# EAGLE design RescueLS (EAGLE 9.6.0)

## Sheet 1 of 2
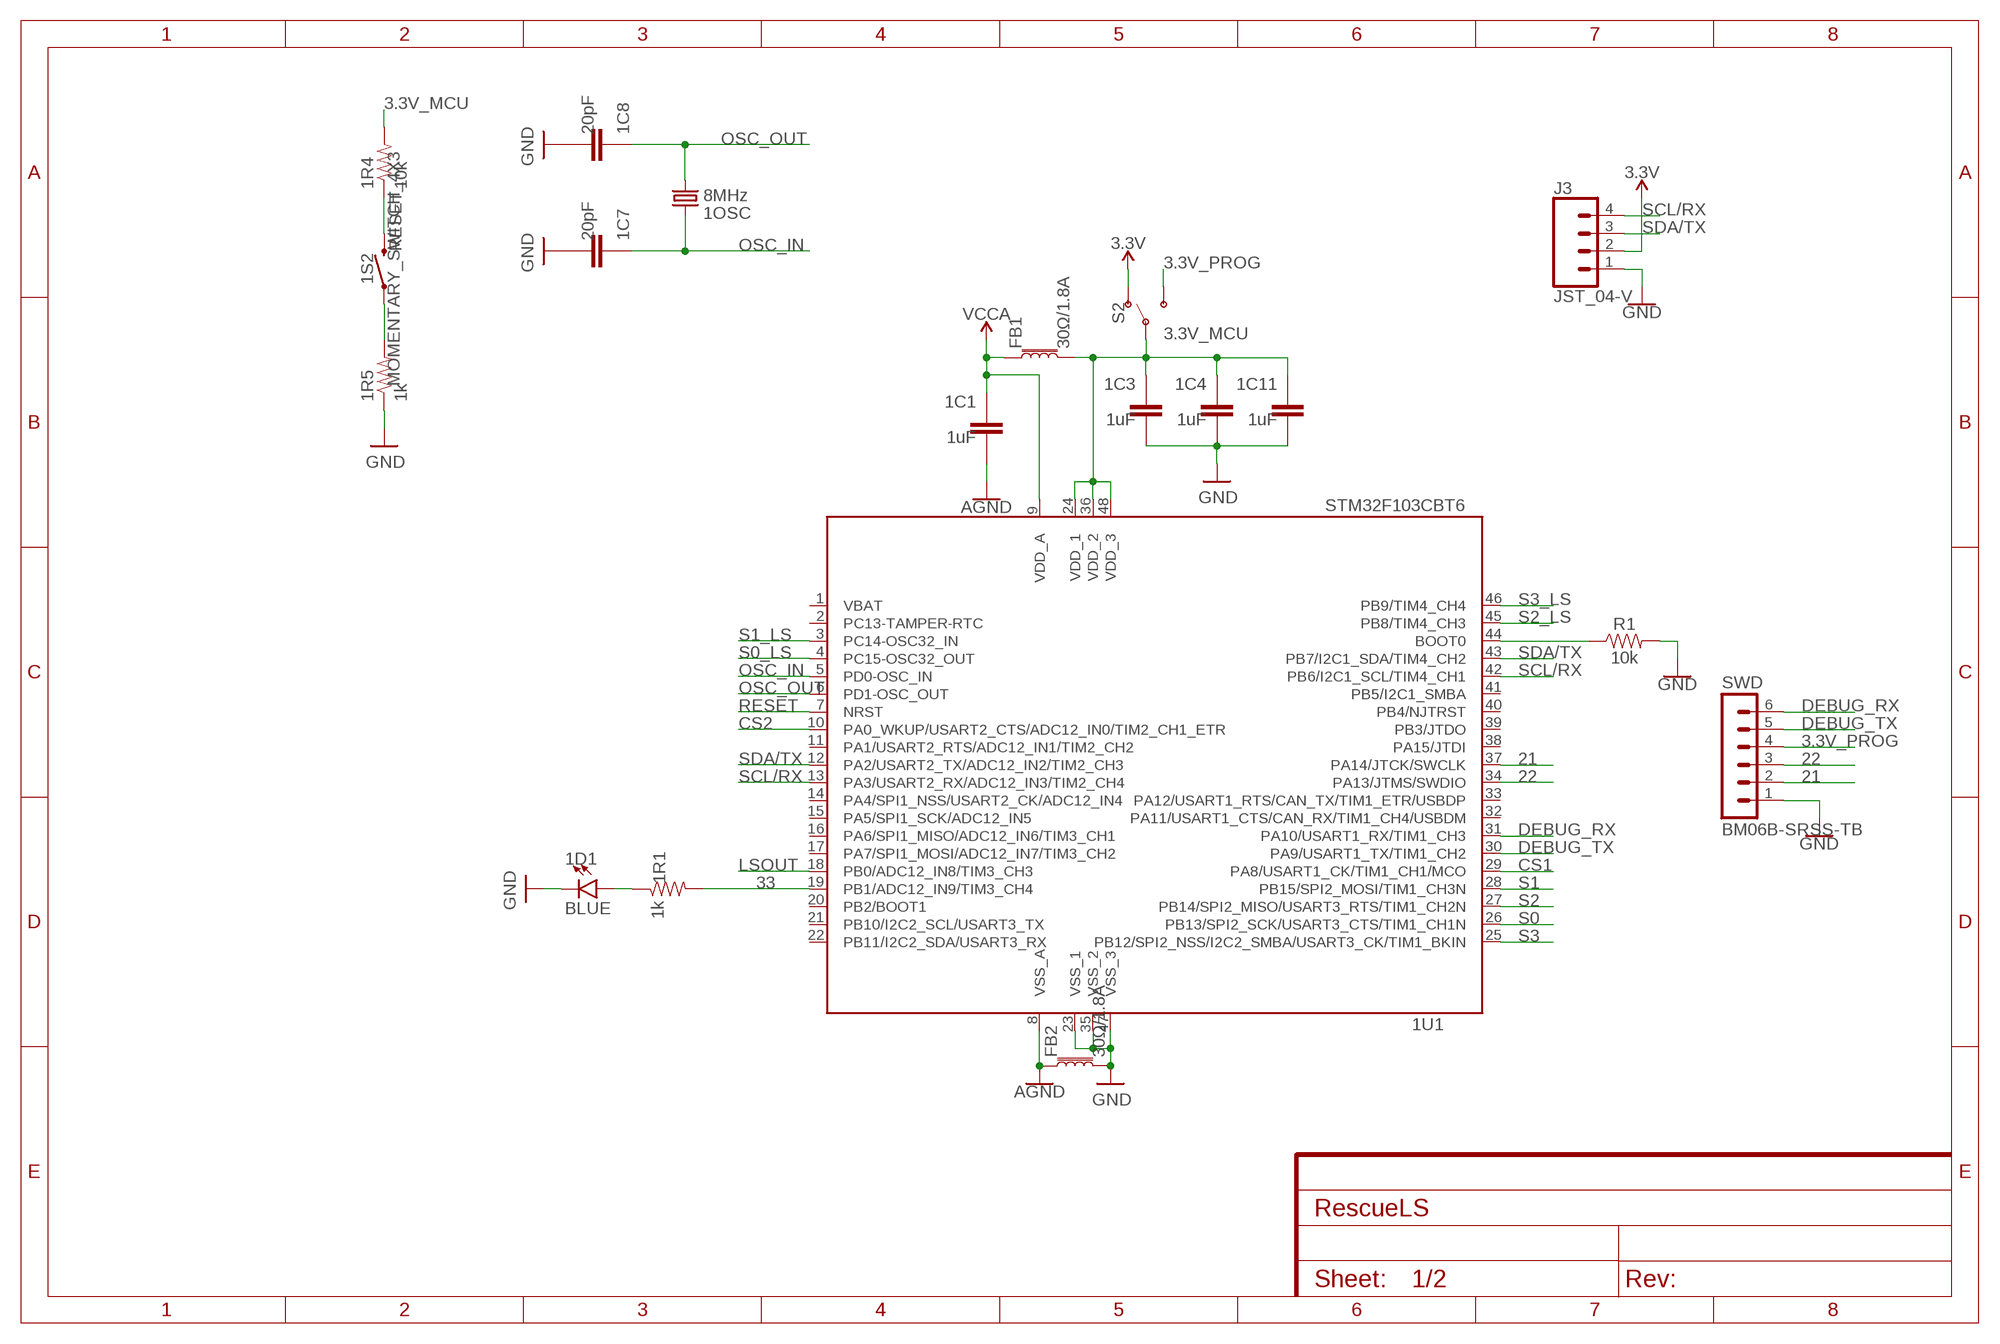
[diagram p0: schematic, sheet 1]

### Parts
1C1  1uF  CAPACITOR0603  [C0603]
1C3  1uF  CAPACITOR0603  [C0603]
1C4  1uF  CAPACITOR0603  [C0603]
1C7  20pF  CAPACITOR0603  [C0603]
1C8  20pF  CAPACITOR0603  [C0603]
1C11  1uF  CAPACITOR0603  [C0603]
1D1  BLUE  LED-BLUE0603  [LED-0603]
1OSC  8MHz  CRYSTALSMD-5X3.2-2PAD  [CRYSTAL-SMD-5X3.2-2PAD]
1R1  1k  RESISTOR0603  [R0603]
1R4  10k  RESISTOR0603  [R0603]
1R5  1k  RESISTOR0603  [R0603]
1S2  MOMENTARY_SWITCH_4X3  [MOMENTARY_SWITCH_4X3]
1U1  STM32F103CBT6  [LQFP48]
FB1  30Ω/1.8A  FERRITE_BEAD-0603  [0603]
FB2  30Ω/1.8A  FERRITE_BEAD-0603  [0603]
J3  JST_04-V  [JST_04-V]
R1  10k  RESISTOR0603  [R0603]
S2  SWITCH-SPDT-PTH-11.6X4.0MM-LOCK  [SWITCH_SPDT_PTH_11.6X4.0MM_LOCK]
SWD  BM06B-SRSS-TB  [BM06B-SRSS-TB]

### Nets
3.3V: J3.2 S2.1(O) ; also sheet 2
3.3V_MCU: 1C3.1 1C4.1 1C11.1 1R4.2 1U1.24(VDD_1) 1U1.36(VDD_2) 1U1.48(VDD_3) FB1.2 S2.2(P) ; also sheet 2
3.3V_PROG: S2.3(S) SWD.4
21: 1U1.37(PA14/JTCK/SWCLK) SWD.2
22: 1U1.34(PA13/JTMS/SWDIO) SWD.3
33: 1R1.2 1U1.19(PB1/ADC12_IN9/TIM3_CH4)
AGND: 1C1.2 1U1.8(VSS_A) FB2.1 ; also sheet 2
CS1: 1U1.29(PA8/USART1_CK/TIM1_CH1/MCO) ; also sheet 2
CS2: 1U1.10(PA0_WKUP/USART2_CTS/ADC12_IN0/TIM2_CH1_ETR) ; also sheet 2
DEBUG_RX: 1U1.31(PA10/USART1_RX/TIM1_CH3) SWD.6
DEBUG_TX: 1U1.30(PA9/USART1_TX/TIM1_CH2) SWD.5
GND: 1C3.2 1C4.2 1C7.2 1C8.2 1C11.2 1D1.C 1R5.1 1U1.23(VSS_1) 1U1.35(VSS_2) 1U1.47(VSS_3) FB2.2 J3.1 R1.2 SWD.1 ; also sheet 2
LSOUT: 1U1.18(PB0/ADC12_IN8/TIM3_CH3) ; also sheet 2
N$2: 1D1.A 1R1.1
N$4: 1R5.2 1S2.P$1
N$23: 1U1.44(BOOT0) R1.1
OSC_IN: 1C7.1 1OSC.P$2 1U1.5(PD0-OSC_IN)
OSC_OUT: 1C8.1 1OSC.P$1 1U1.6(PD1-OSC_OUT)
RESET: 1R4.1 1S2.P$2 1U1.7(NRST)
S0: 1U1.26(PB13/SPI2_SCK/USART3_CTS/TIM1_CH1N) ; also sheet 2
S0_LS: 1U1.4(PC15-OSC32_OUT) ; also sheet 2
S1: 1U1.28(PB15/SPI2_MOSI/TIM1_CH3N) ; also sheet 2
S1_LS: 1U1.3(PC14-OSC32_IN) ; also sheet 2
S2: 1U1.27(PB14/SPI2_MISO/USART3_RTS/TIM1_CH2N) ; also sheet 2
S2_LS: 1U1.45(PB8/TIM4_CH3) ; also sheet 2
S3: 1U1.25(PB12/SPI2_NSS/I2C2_SMBA/USART3_CK/TIM1_BKIN) ; also sheet 2
S3_LS: 1U1.46(PB9/TIM4_CH4) ; also sheet 2
SCL/RX: 1U1.13(PA3/USART2_RX/ADC12_IN3/TIM2_CH4) 1U1.42(PB6/I2C1_SCL/TIM4_CH1) J3.4
SDA/TX: 1U1.12(PA2/USART2_TX/ADC12_IN2/TIM2_CH3) 1U1.43(PB7/I2C1_SDA/TIM4_CH2) J3.3
VCCA: 1C1.1 1U1.9(VDD_A) FB1.1 ; also sheet 2
Unconnected: 1U1.2(PC13-TAMPER-RTC) 1U1.11(PA1/USART2_RTS/ADC12_IN1/TIM2_CH2) 1U1.14(PA4/SPI1_NSS/USART2_CK/ADC12_IN4) 1U1.15(PA5/SPI1_SCK/ADC12_IN5) 1U1.16(PA6/SPI1_MISO/ADC12_IN6/TIM3_CH1) 1U1.17(PA7/SPI1_MOSI/ADC12_IN7/TIM3_CH2) 1U1.20(PB2/BOOT1) 1U1.21(PB10/I2C2_SCL/USART3_TX) 1U1.22(PB11/I2C2_SDA/USART3_RX) 1U1.32(PA11/USART1_CTS/CAN_RX/TIM1_CH4/USBDM) 1U1.33(PA12/USART1_RTS/CAN_TX/TIM1_ETR/USBDP) 1U1.38(PA15/JTDI) 1U1.39(PB3/JTDO) 1U1.40(PB4/NJTRST) 1U1.41(PB5/I2C1_SMBA)

## Sheet 2 of 2
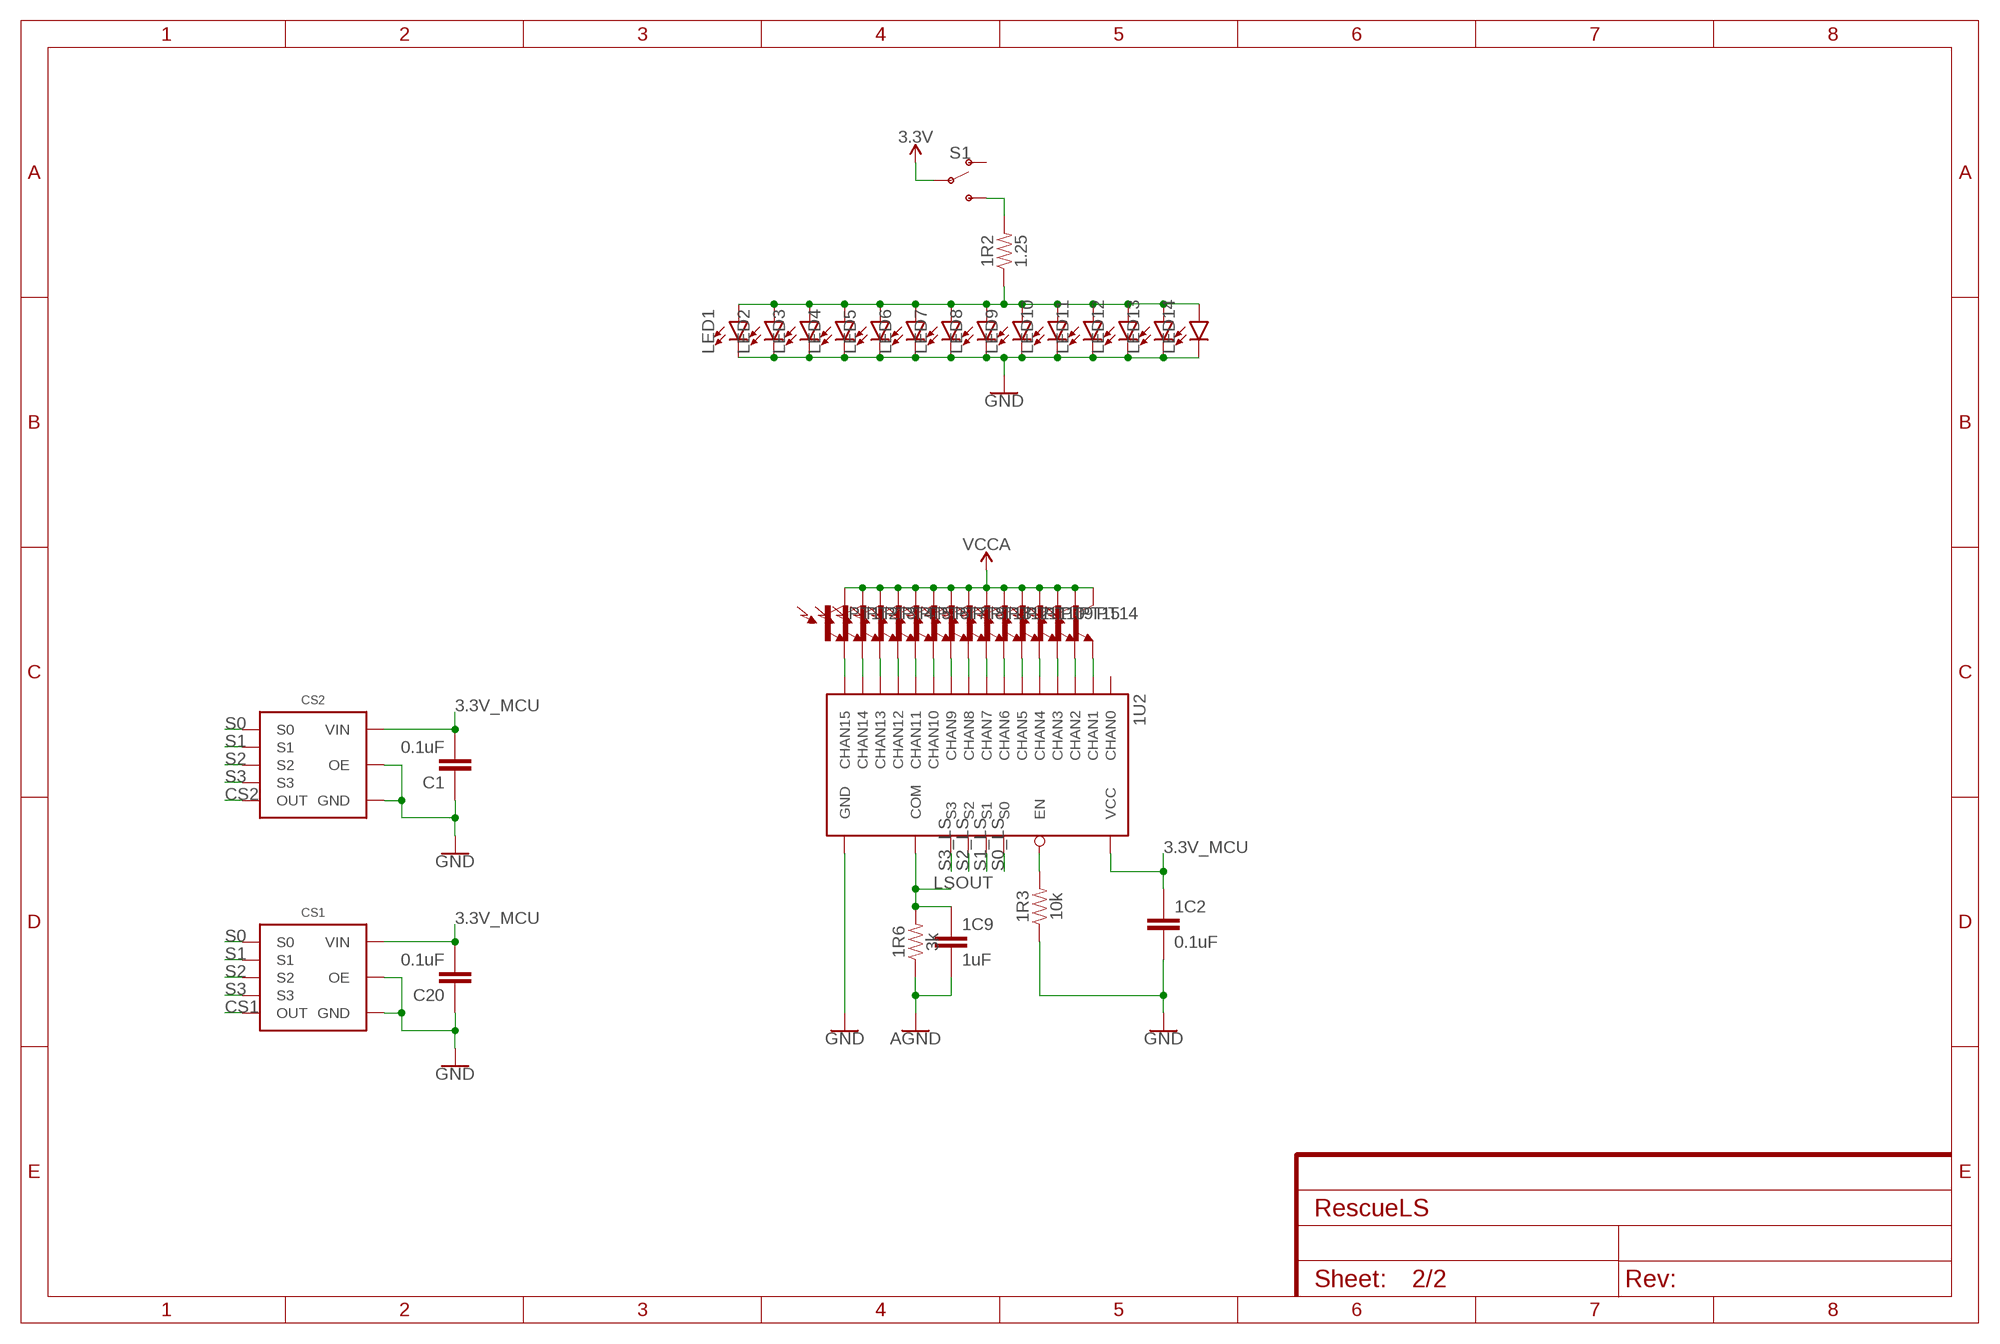
[diagram p1: schematic, sheet 2]

### Parts
1C2  0.1uF  CAPACITOR0603  [C0603]
1C9  1uF  CAPACITOR0603  [C0603]
1R2  1.25  RESISTOR0603  [R0603]
1R3  10k  RESISTOR0603  [R0603]
1R6  3k  RESISTOR0603  [R0603]
1U2  74HC4067  [SOIC-24]
C1  0.1uF  CAPACITOR0603  [C0603]
C20  0.1uF  CAPACITOR0603  [C0603]
CS1  TCS3200  [SOIC-8]
CS2  TCS3200  [SOIC-8]
LED1  3528LED  [3528]
LED2  3528LED  [3528]
LED3  3528LED  [3528]
LED4  3528LED  [3528]
LED5  3528LED  [3528]
LED6  3528LED  [3528]
LED7  3528LED  [3528]
LED8  3528LED  [3528]
LED9  3528LED  [3528]
LED10  3528LED  [3528]
LED11  3528LED  [3528]
LED12  3528LED  [3528]
LED13  3528LED  [3528]
LED14  3528LED  [3528]
PT1  LIGHT_SENSORALS  [ALS-PT19]
PT2  LIGHT_SENSORALS  [ALS-PT19]
PT3  LIGHT_SENSORALS  [ALS-PT19]
PT4  LIGHT_SENSORALS  [ALS-PT19]
PT5  LIGHT_SENSORALS  [ALS-PT19]
PT6  LIGHT_SENSORALS  [ALS-PT19]
PT7  LIGHT_SENSORALS  [ALS-PT19]
PT8  LIGHT_SENSORALS  [ALS-PT19]
PT9  LIGHT_SENSORALS  [ALS-PT19]
PT10  LIGHT_SENSORALS  [ALS-PT19]
PT11  LIGHT_SENSORALS  [ALS-PT19]
PT12  LIGHT_SENSORALS  [ALS-PT19]
PT13  LIGHT_SENSORALS  [ALS-PT19]
PT14  LIGHT_SENSORALS  [ALS-PT19]
PT15  LIGHT_SENSORALS  [ALS-PT19]
S1  SWITCH-SPDT-PTH-11.6X4.0MM-LOCK  [SWITCH_SPDT_PTH_11.6X4.0MM_LOCK]

### Nets
3.3V: S1.2(P) ; also sheet 1
3.3V_MCU: 1C2.1 1U2.P24(VCC) C1.2 C20.2 CS1.5(VIN) CS2.5(VIN) ; also sheet 1
AGND: 1C9.2 1R6.1 ; also sheet 1
CS1: CS1.6(OUT) ; also sheet 1
CS2: CS2.6(OUT) ; also sheet 1
GND: 1C2.2 1R3.1 1U2.P12(GND) C1.1 C20.1 CS1.3(OE) CS1.4(GND) CS2.3(OE) CS2.4(GND) LED1.C LED2.C LED3.C LED4.C LED5.C LED6.C LED7.C LED8.C LED9.C LED10.C LED11.C LED12.C LED13.C LED14.C ; also sheet 1
LSOUT: 1C9.1 1R6.2 1U2.P1(COM) ; also sheet 1
N$1: 1U2.P8(CHAN1) PT14.E(E1)
N$3: 1R2.1 LED1.A LED2.A LED3.A LED4.A LED5.A LED6.A LED7.A LED8.A LED9.A LED10.A LED11.A LED12.A LED13.A LED14.A
N$5: 1R2.2 S1.3(S)
N$6: 1U2.P6(CHAN3) PT9.E(E1)
N$7: 1U2.P5(CHAN4) PT10.E(E1)
N$8: 1U2.P4(CHAN5) PT11.E(E1)
N$9: 1U2.P3(CHAN6) PT12.E(E1)
N$10: 1U2.P2(CHAN7) PT13.E(E1)
N$11: 1U2.P7(CHAN2) PT15.E(E1)
N$20: 1R3.2 1U2.P15(EN)
N$24: 1U2.P16(CHAN15) PT1.E(E1)
N$25: 1U2.P17(CHAN14) PT2.E(E1)
N$26: 1U2.P18(CHAN13) PT3.E(E1)
N$27: 1U2.P19(CHAN12) PT4.E(E1)
N$28: 1U2.P20(CHAN11) PT5.E(E1)
N$29: 1U2.P21(CHAN10) PT6.E(E1)
N$30: 1U2.P22(CHAN9) PT7.E(E1)
N$31: 1U2.P23(CHAN8) PT8.E(E1)
S0: CS1.1(S0) CS2.1(S0) ; also sheet 1
S0_LS: 1U2.P10(S0) ; also sheet 1
S1: CS1.2(S1) CS2.2(S1) ; also sheet 1
S1_LS: 1U2.P11(S1) ; also sheet 1
S2: CS1.7(S2) CS2.7(S2) ; also sheet 1
S2_LS: 1U2.P14(S2) ; also sheet 1
S3: CS1.8(S3) CS2.8(S3) ; also sheet 1
S3_LS: 1U2.P13(S3) ; also sheet 1
VCCA: PT1.C(C1) PT2.C(C1) PT3.C(C1) PT4.C(C1) PT5.C(C1) PT6.C(C1) PT7.C(C1) PT8.C(C1) PT9.C(C1) PT10.C(C1) PT11.C(C1) PT12.C(C1) PT13.C(C1) PT14.C(C1) PT15.C(C1) ; also sheet 1
Unconnected: 1U2.P9(CHAN0) S1.1(O)

## Power pins joined to a net without a drawn wire
VBAT: 1U1.1(VBAT)

## Library data of the parts
1C1-1C4 1C7-1C9 1C11 C1 C20 = JH:CAPACITOR
1D1 = SparkFun-LED:LED-BLUE: Blue SMD LED Used in manufacturing of various products at SparkFun Packages: 0603 - SMD 0603 package [Product Link] <http://www.digikey.com/product-detail/en/SMLE12BC7TT86/511-1589-2-ND/1641808> 1206 - SMD1206 package [Product Link] <http://www.digikey.com/product-detail/en/lite-on-inc/LTST-C150TBKT/160-1643-1-ND/573584> SparkFun Products: ESP8266 Thing-Dev Board <https://www.sparkfun.com/products/13711> RedBoard <https://www.sparkfun.com/products/12757>; PROD_ID: DIO-08575
1OSC = SparkFun-Clocks:CRYSTAL: Crystals (Generic) These are passive quartz crystals, which can be used as a clock source for a microcontroller. Crystal's are two-terminal devices. They require external "load" capacitors to generate an oscillating signal.
1R1-1R6 R1 = JH:RESISTOR
1S2 = JH:MOMENTARY_SWITCH_4X3
1U1 = JH:STM32F103CBT6
1U2 = JH:74HC4067
CS1 CS2 = JH:TCS3200
FB1 FB2 = SparkFun-Coils:FERRITE_BEAD: Ferrite Bead (blocks, cores, rings, chokes, etc.) Inductor with layers of ferrite used to suppress high frequencies. Often used to isolate high frequency noise. SparkFun Products: IOIO-OTG - V2.2 <https://www.sparkfun.com/products/13613> SparkFun SAMD21 Mini Breakout <https://www.sparkfun.com/products/13664> SparkFun 6 Degrees of Freedom Breakout - LSM6DS3 <https://www.sparkfun.com/products/13339> SparkFun SAMD21 Dev Breakout <https://www.sparkfun.com/products/13672>; PROD_ID: NDUC-07859
J3 = JH:JST_04
LED1-LED14 = JH:3528LED
PT1-PT15 = SparkFun-Sensors:LIGHT_SENSOR: Ambient Light Sensors - Phototransistors Low cost ambient light sensors, consisting of a phototransistor in miniature SMD packages. Output voltage varies with light intensity. SparkFun Products ALS-PT19 Light Sensor <https://www.sparkfun.com/products/12566> (SEN-12566) Ambient Light Sensor - TEMT6000 <https://www.sparkfun.com/products/8348> (SEN-08348) SparkFun Ambient Light Sensor Breakout - TEMT60000 <https://www.sparkfun.com/products/8688> (SEN-08688); PROD_ID: IC-11836; SF_ID: SEN-12566
S1 S2 = SparkFun-Switches:SWITCH-SPDT: Single Pole, Double Throw (SPDT) Switch Single-pole, double-throw (SPDT) switch. Variant Overview SMD-AYZ0202 Surface Mount DPDT Switch <https://www.sparkfun.com/products/597> (COM-00597) Used on e.g. LilyPad Arduino USB - ATmega32U4 Board <https://www.sparkfun.com/products/12049> PTH-11.6X4.0MM SPDT Mini Power Switch <https://www.sparkfun.com/products/102> (COM-00102) Used on e.g. SparkFun Simon Says - Through-Hole Soldering Kit <https://www.sparkfun.com/products/10547> (KIT-10547) PTH-11.6X4.0MM-KIT KIT version of SPDT Mini Power Switch - Simplifies soldering by removing tStop of switch pins - only one side can be soldered. PTH-11.6X4.0MM-LOCK LOCK version of SPDT Mini Power Switch - Offset pins hold switch in place for easier soldering. SMD-RIGHT-ANGLE Surface Mount Right Angle Switch <https://www.sparkfun.com/products/10860> (COM-10860) Used on e.g. SparkFun ESP8266 Thing <https://www.sparkfun.com/products/13231>; PROD_ID: SWCH-08261; SF_SKU: COM-00102
SWD = con-JST SH:BM06B-SRSS: JST SH series header 1.00mm pitch disconnectable crimp style connectors, vertical (side entry type), 6 pins

## Board
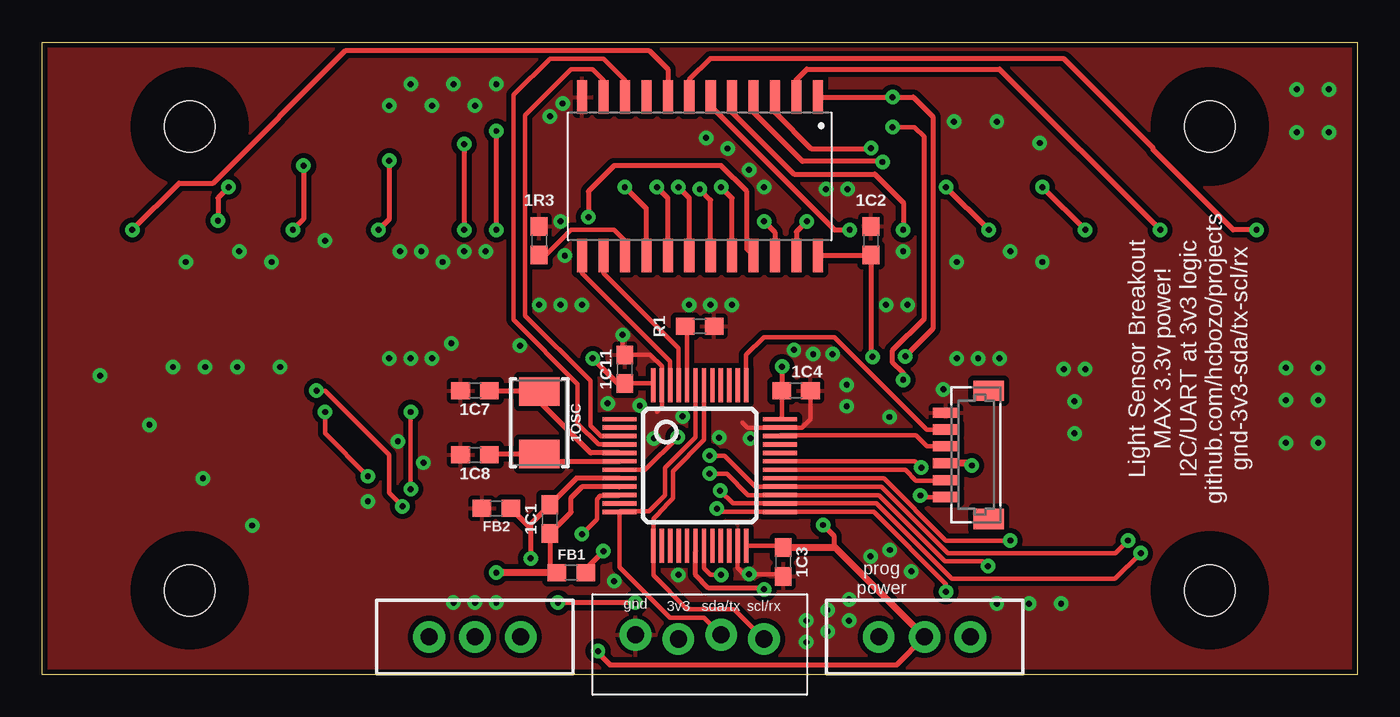
[diagram p2: board, top side]
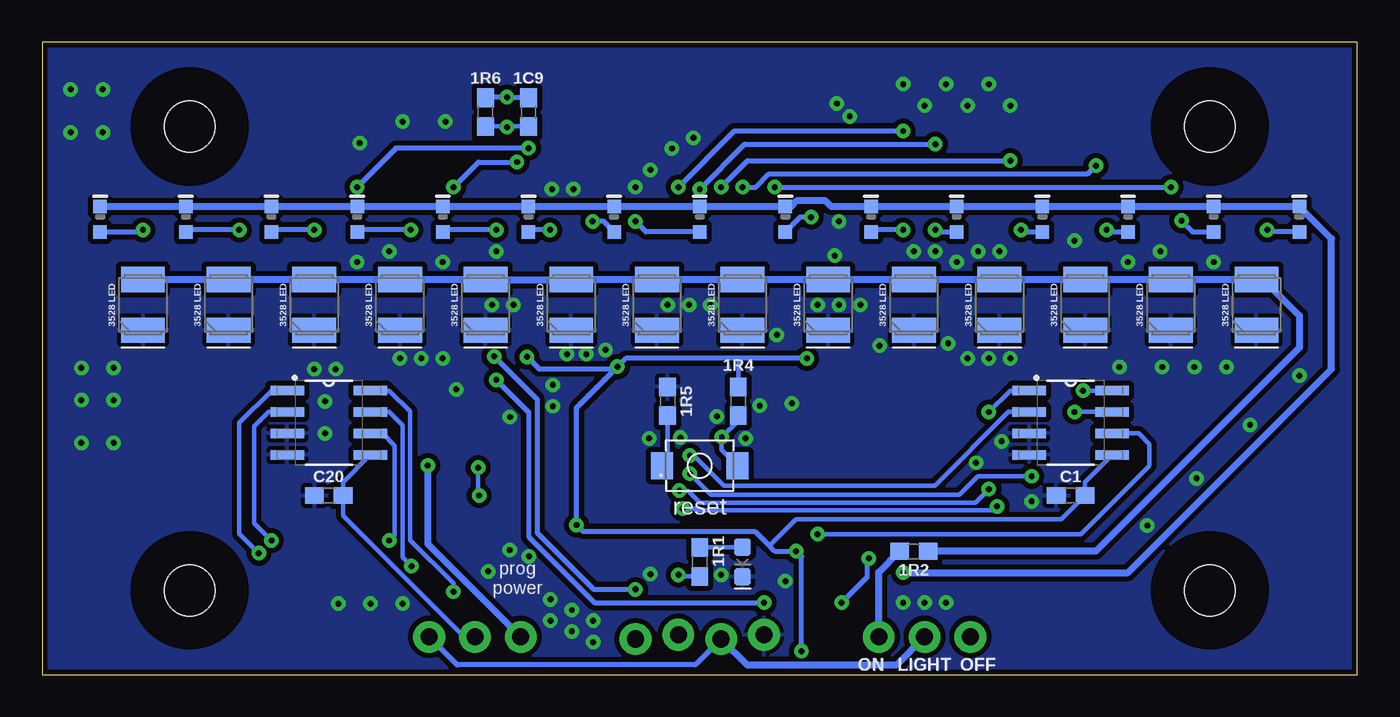
[diagram p3: board, bottom side, seen from below]

Size 78 x 37.5 mm. Coordinates in mm from the lower left corner, seen from the top.
Outline: 78,0 0,0 0,37.5 78,37.5 78,0
Copper layers (1*16): Top 0.035mm / dielectric 1.5mm / Bottom 0.035mm
Design rules "mine": minimum track width 10mil, minimum drill 10mil, track to track 8mil, track to pad 8mil, pad to pad 8mil, via to via 8mil, smd to smd 8mil, copper to edge 8mil, drill to drill 8mil, minimum pad ring 12mil, minimum via ring 10mil, stop-mask expansion 4mil, vias tented up to drill 25mil, thermal gap 10mil
Holes 3 mm at 8.75,32.5 8.75,5 69.25,5 69.25,32.5
tRestrict: area 5.5,1.8 to 11.9,8.2; area 5.5,29.3 to 11.9,35.7; area 66,29.3 to 72.5,35.7; area 66,1.8 to 72.5,8.2
bRestrict: area 5.5,29.3 to 11.9,35.7; area 5.5,1.8 to 11.9,8.2; area 66,1.8 to 72.5,8.2; area 66,29.3 to 72.5,35.7

### Footprints (pad centres in the part's own frame; a part is rotated, then mirrored left to right if it is on the bottom)
C0603 = smd 1.1 x 1: 1 -0.85,0; 2 0.85,0
LED-0603 = smd 1 x 1: A -0.877,0; C 0.877,0
CRYSTAL-SMD-5X3.2-2PAD = smd 1.7 x 2.4: P$1 1.85,0; P$2 -1.85,0
R0603 = smd 1.1 x 1: 1 -0.85,0; 2 0.85,0
MOMENTARY_SWITCH_4X3 = smd 1.3 x 1.6: P$1 -2.25,0; P$2 2.25,0
LQFP48 = smd 0.254 x 2.032: 1 -2.75,-4.758; 2 -2.25,-4.758; 3 -1.75,-4.758; 4 -1.25,-4.758; 5 -0.75,-4.758; 6 -0.25,-4.758; 7 0.25,-4.758; 8 0.75,-4.758; 9 1.25,-4.758; 10 1.75,-4.758; 11 2.25,-4.758; 12 2.75,-4.758; 25 2.75,4.758; 26 2.25,4.758; 27 1.75,4.758; 28 1.25,4.758; 29 0.75,4.758; 30 0.25,4.758; 31 -0.25,4.758; 32 -0.75,4.758; 33 -1.25,4.758; 34 -1.75,4.758; 35 -2.25,4.758; 36 -2.75,4.758 | smd 2.032 x 0.254: 13 4.758,-2.75; 14 4.758,-2.25; 15 4.758,-1.75; 16 4.758,-1.25; 17 4.758,-0.75; 18 4.758,-0.25; 19 4.758,0.25; 20 4.758,0.75; 21 4.758,1.25; 22 4.758,1.75; 23 4.758,2.25; 24 4.758,2.75; 37 -4.758,2.75; 38 -4.758,2.25; 39 -4.758,1.75; 40 -4.758,1.25; 41 -4.758,0.75; 42 -4.758,0.25; 43 -4.758,-0.25; 44 -4.758,-0.75; 45 -4.758,-1.25; 46 -4.758,-1.75; 47 -4.758,-2.25; 48 -4.758,-2.75
SOIC-24 = smd 2 x 0.6: P1 -4.7,7; P2 -4.7,5.73; P3 -4.7,4.46; P4 -4.7,3.19; P5 -4.7,1.92; P6 -4.7,0.65; P7 -4.7,-0.62; P8 -4.7,-1.89; P9 -4.7,-3.16; P10 -4.7,-4.43; P11 -4.7,-5.7; P12 -4.7,-6.97; P13 4.7,-6.97; P14 4.7,-5.7; P15 4.7,-4.43; P16 4.7,-3.16; P17 4.7,-1.89; P18 4.7,-0.62; P19 4.7,0.65; P20 4.7,1.92; P21 4.7,3.19; P22 4.7,4.46; P23 4.7,5.73; P24 4.7,7
SOIC-8 = smd 1.981 x 0.559: 1 -2.464,1.905; 2 -2.464,0.635; 3 -2.464,-0.635; 4 -2.464,-1.905; 5 2.464,-1.905; 6 2.464,-0.635; 7 2.464,0.635; 8 2.464,1.905
0603 = smd 1.1 x 1: 1 -0.85,0; 2 0.85,0
JST_04-V = drill 1.016 pad 1.88: 1 0,0.127; 2 2.54,-0.127; 3 5.08,0.127; 4 7.62,-0.127
3528 = smd 1.5 x 2.6: A -1.5,0; C 1.5,0
ALS-PT19 = smd 0.8 x 0.8: C -0.75,0; E 0.75,0
SWITCH_SPDT_PTH_11.6X4.0MM_LOCK = drill 1.016 pad 1.88: 1 0,2.718; 2 0,0; 3 0,-2.718
BM06B-SRSS-TB = smd 0.6 x 1.55: 1 2.5,0; 2 1.5,0; 3 0.5,0; 4 -0.5,0; 5 -1.5,0; 6 -2.5,0 | smd 1.2 x 1.8: M1 3.8,-2.525; M2 -3.8,-2.525

### Placement (x,y rotation side)
1C1  30.11,9.22 90 top
1C2  49.16,25.73 90 top
1C3  43.95,6.69 270 top
1C4  44.72,16.84 0 top
1C7  25.66,16.84 180 top
1C8  25.66,13.04 180 top
1C9  49.16,33.36 270 bottom
1C11  34.55,18.11 90 top
1D1  36.46,6.69 270 bottom
1OSC  29.48,14.94 270 top
1R1  39,6.69 270 bottom
1R2  26.3,7.32 180 bottom
1R3  29.48,25.73 270 top
1R4  36.71,16.21 90 bottom
1R5  40.91,16.21 270 bottom
1R6  51.7,33.36 90 bottom
1S2  39,12.4 0 bottom
1U1  39,12.4 270 top
1U2  39,29.55 270 top
C1  17,10.62 0 bottom
C20  61,10.62 0 bottom
CS1  61,14.94 0 bottom
CS2  17,14.94 0 bottom
FB1  31.38,6.05 0 top
FB2  26.94,9.86 180 top
J3  35.19,2.24 0 top
LED1  11.06,21.93 270 bottom
LED2  16.14,21.93 270 bottom
LED3  21.22,21.93 270 bottom
LED4  26.3,21.93 270 bottom
LED5  31.38,21.93 270 bottom
LED6  36.46,21.93 270 bottom
LED7  41.54,21.93 270 bottom
LED8  46.62,21.93 270 bottom
LED9  51.7,21.93 270 bottom
LED10  56.78,21.93 270 bottom
LED11  61.86,21.93 270 bottom
LED12  66.94,21.93 270 bottom
LED13  72.02,21.93 270 bottom
LED14  5.98,21.93 270 bottom
PT1  8.52,27.01 270 bottom
PT2  13.6,27.01 270 bottom
PT3  18.68,27.01 270 bottom
PT4  23.76,27.01 270 bottom
PT5  28.84,27.01 270 bottom
PT6  33.92,27.01 270 bottom
PT7  39,27.01 270 bottom
PT8  44.08,27.01 270 bottom
PT9  49.16,27.01 270 bottom
PT10  54.24,27.01 270 bottom
PT11  59.32,27.01 270 bottom
PT12  64.4,27.01 270 bottom
PT13  69.48,27.01 270 bottom
PT14  3.44,27.01 270 bottom
PT15  74.56,27.01 270 bottom
R1  39,20.66 0 top
S1  25.66,2.24 90 top
S2  52.34,2.24 270 top
SWD  53.61,13.04 90 top

### Tracks (layer width: path | path; a pad name or v marks a point on that pad's centre or on a via)
3.3V
  Bottom 0.305: J3.2 39.25,0.59 53.4,0.59 S2.1
  Bottom 0.406: S1.2 27.34,0.56 36.18,0.56 J3.2
3.3V_MCU  (via drill 0.35)
  Top 0.254: 1C11.1 36.14,17.27 1U1.48 | 1C4.1 43.87,15.26 1U1.36 | 1C3.1 43.85,7.64 1U1.24
  Top 0.305: v32.65,18.75 34.13,17.27 1C11.1 | v43.88,18.26 43.87,18.25 1C4.1 | S2.2 50.68,0.59 33.67,0.59 32.97,1.29 v32.97,1.4 | FB1.2 32.23,6.27 v33.28,7.32 | v46.31,8.88 46.95,8.24 46.95,7.54 44.72,7.54 | 1U2.P24 49.12,24.84 1C2.1 49.16,18.93 v49.25,18.84
  Top 0.406: S2.2 47.04,7.54 44.72,7.54 1C3.1
  Bottom 0.254: 1R4.2 36.71,18.75 | S2.2 52.97,2.24 60.15,9.42 C20.2 60.15,11.42 CS1.5 | CS2.5 16.15,11.42 C1.2 17.55,9.22 33.28,9.22 34.87,7.64
  Bottom 0.305: v32.65,18.75 36.71,18.75 43.39,18.75 v43.88,18.26 | v49.25,18.84 48.55,18.14 44,18.14 v43.88,18.26 | v32.97,1.4 32.97,7 v33.28,7.32 34.55,7.32 34.87,7.64 35.73,8.49 45.93,8.49 v46.31,8.88 46.31,15.83 v43.88,18.26
3.3V_PROG  (via drill 0.35)
  Top 0.406: v55.13,12.4 54.99,12.54 SWD.4
  Bottom 0.406: S2.3 55.13,7.75 v55.13,12.4
21
  Top 0.254: SWD.2 52.49,14.54 47,20.02 42.81,20.02 41.75,18.96 1U1.37
22
  Top 0.254: SWD.3 52.47,13.54 51.81,14.19 43.8,14.19 1U1.34
33  (via drill 0.35)
  Top 0.254: v40.27,5.92 39.63,5.92 39.25,6.31 1U1.19
  Bottom 0.254: v40.27,5.92 40.18,5.84 1R1.2
AGND  (via drill 0.35)
  Top 0.254: 1U1.8 | 52.31,31.89 51.74,32.47 v50.43,32.47
  Top 0.305: FB2.1 28.97,8.68 v28.97,6.9 28.97,8.93 1C1.2 31.69,11.66 1U1.8 | v51.06,17.48 51.06,17.89 50.41,18.55 50.41,19.2 52.31,21.11 52.31,31.89 | v35.19,4.27 v30.59,4.27
  Bottom 0.254: 1C9.2 50.39,32.51 v50.43,32.47 50.47,32.51 1R6.1
  Bottom 0.305: v51.06,17.48 49.15,15.56 49.15,8.19 45.23,4.27 v35.19,4.27 | v30.59,4.27 29.06,5.81 29.06,6.9 v28.97,6.9
CS1  (via drill 0.35)
  Top 0.254: 1U1.29 49.91,11.65 53.61,7.96 v57.41,7.96
  Bottom 0.254: v57.41,7.96 57.09,8.28 57.09,13.58 57.81,14.3 CS1.6
CS2  (via drill 0.35)
  Top 0.254: 1U1.10 34.2,10.61 33.09,10.61 32.9,10.41 32.9,9.22 v32.02,8.34
  Bottom 0.254: v32.02,8.34 16.39,8.34 12.33,12.4 12.33,13.67 12.96,14.3 CS2.6
DEBUG_RX  (via drill 0.35)
  Top 0.254: 1U1.31 51.76,12.65 v52.14,12.27 | v52.08,10.62 52.17,10.54 SWD.6
  Bottom 0.254: v52.14,12.27 52.14,10.68 v52.08,10.62
DEBUG_TX
  Top 0.254: 1U1.30 51.19,12.15 51.83,11.51 53.58,11.51 SWD.5
GND  (via drill 0.35)
  Top 0.254: 1U1.23 41.25,6.34 41.63,5.96 v41.92,5.96 43.83,5.96 1C3.2 | 1C4.2 45.56,15.15 45.06,14.65 1U1.35 41.83,14.65 41.54,14.94 | v34.43,20.15 34.43,19.09 1C11.2 36.06,18.96 36.75,18.28 1U1.47 36.75,15.87 36.46,15.57
  other vias: 37.73,5.92 20.59,18.75 21.86,18.75 23.12,18.75 24.27,19.64 28.33,19.51 29.48,21.93 30.74,21.93 32.02,21.93 38.37,21.93 39.63,21.93 40.91,21.93 50.05,21.93 51.32,21.93 31,24.85 30.74,26.88 41.92,29.93 42.81,28.91 46.49,28.78 47.76,28.78 53.45,16.92 50.25,15.28 33.92,5.54 44.59,19.26 19.32,10.28 21.09,13.84 35.44,15.96 40.14,14.05 37.98,15.32 26.94,4.27 25.66,4.27 24.39,4.27 12.46,8.84 3.44,17.73 6.36,14.81 9.54,11.64 7.76,18.24 9.66,18.24 11.57,18.24 14.11,18.24 22.62,12.57 26.3,25.1 25.03,25.1 23.76,24.46 22.49,25.1 21.22,25.1 54.24,18.75 55.51,18.75 56.78,18.75 54.24,24.46 57.41,25.1 59.32,24.46 51.06,25.1 60.59,18.11 61.86,18.11 61.23,16.21 61.23,14.3 47.71,15.91 42,14.01 36.28,14.01 50.27,7.39 51.54,6.12 49.13,7.01 56.62,4.22 58.53,4.22 60.43,4.22 73.77,18.19 75.67,18.19 75.67,16.28 73.77,16.28 73.77,13.74 75.67,13.74 74.4,34.7 76.31,34.7 74.4,32.16 76.31,32.16 54.08,32.79 56.62,32.79 59.16,31.52 40.65,31.2 39.38,31.83 30.87,33.86 30.11,33.1 26.94,35.01 25.66,33.74 24.39,35.01 23.12,33.74 21.86,35.01 20.59,33.74 16.77,25.73 13.6,24.46 11.7,25.1 8.52,24.46 33.54,16.08 47.71,17.18 46.87,19 45.73,19 47.86,4.47 46.59,3.84 45.32,3.2 45.32,1.93 46.59,2.57 47.86,3.2
  pour Top (isolate 0.305): 0.27,37.16 0.27,0.34 77.73,0.34 77.73,37.16
  pour Bottom (isolate 0.305): 77.73,37.16 77.73,0.34 0.27,0.34 0.27,37.16
LSOUT  (via drill 0.35)
  Top 0.254: 38.75,7.32 1U1.18
  Top 0.305: v51.19,18.88 52.82,20.5 52.82,33.09 51.66,34.24 v50.43,34.24 1U2.P1 | 38.75,7.32 38.75,5.92 39.53,5.14 42.73,5.14 v42.81,5.06
  Bottom 0.305: 1C9.1 49.12,34.24 v50.43,34.24 51.66,34.24 1R6.2 | v51.19,18.88 48.64,16.32 48.64,8.4 45.29,5.06 v42.81,5.06
N$1  (via drill 0.35)
  Top 0.305: v5.34,26.37 8.12,29.15 10.14,29.15 18,37.01 35.98,37.01 37.11,35.88 1U2.P8
  Bottom 0.305: PT14.E 5.23,26.25 v5.34,26.37
N$2
  Bottom 0.254: 1D1.A 38.97,7.56 1R1.1
N$3
  Bottom 0.406: 1R2.1 15.5,7.32 3.44,19.39 3.44,21.29 5.58,23.43 LED14.A LED1.A LED2.A LED3.A LED4.A LED5.A LED6.A LED7.A LED8.A LED9.A LED10.A LED11.A LED12.A LED13.A
N$4
  Bottom 0.254: 1S2.P$1 40.91,12.75 1R5.2
N$5
  Bottom 0.406: S1.3 28.38,6.09 1R2.2
N$6  (via drill 0.35)
  Top 0.305: 1U2.P6 39.63,34.22 39.63,33.73 46.99,26.37 v47.89,26.37
  Bottom 0.305: v47.89,26.37 49.05,26.37 PT9.E
N$7  (via drill 0.35)
  Top 0.305: 1U2.P5 40.92,33.34 44.59,29.67 49.38,29.67 51.06,27.99 v51.06,26.37
  Bottom 0.305: v51.06,26.37 54.12,26.37 PT10.E
N$8  (via drill 0.35)
  Top 0.305: 1U2.P4 42.19,33.34 45.1,30.43 49.8,30.43 v49.84,30.39 | v56.14,26.37 v53.61,28.91
  Bottom 0.305: v56.14,26.37 59.2,26.37 PT11.E | v53.61,28.91 52.12,30.39 v49.84,30.39
N$9  (via drill 0.35)
  Top 0.305: 1U2.P3 43.46,33.34 45.6,31.2 49.14,31.2 v49.16,31.22 | v59.32,28.91 v61.86,26.37
  Bottom 0.305: v61.86,26.37 64.28,26.37 PT12.E | v49.16,31.22 57.01,31.22 v59.32,28.91
N$10  (via drill 0.35)
  Top 0.305: 1U2.P2 44.73,35.27 45.35,35.89 56.78,35.89 v66.31,26.37
  Bottom 0.305: v66.31,26.37 69.36,26.37 PT13.E
N$11  (via drill 0.35)
  Top 0.305: v72.02,26.37 70.64,26.37 65.9,31.11 65.9,31.22 60.59,36.53 39.63,36.53 38.37,35.26 38.37,34.26 1U2.P7
  Bottom 0.305: PT15.E 72.13,26.25 v72.02,26.37
N$20
  Top 0.254: 1R3.2 29.89,24.88 31.38,26.37 33.92,26.37 34.57,25.72 1U2.P15
N$23
  Top 0.254: 1U1.44 38.25,20.55 R1.1
N$24  (via drill 0.35)
  Top 0.305: 1U2.P16 35.84,27.62 v34.55,28.91 | v11.06,28.91 10.43,28.27 v10.43,26.92
  Bottom 0.305: v34.55,28.91 v11.06,28.91 | v10.43,26.92 9.76,26.25 PT1.E
N$25  (via drill 0.35)
  Top 0.305: 1U2.P17 37.11,28.26 v36.46,28.91 | v15.5,30.18 15.5,27.01 v14.87,26.37
  Bottom 0.305: v36.46,28.91 35.66,28.91 34.88,29.7 15.99,29.7 v15.5,30.18 | v14.87,26.37 14.75,26.25 PT2.E
N$26  (via drill 0.35)
  Top 0.305: 1U2.P18 38.38,28.26 v37.73,28.91 | v20.59,30.48 20.59,27.01 v19.95,26.37
  Bottom 0.305: v37.73,28.91 36.16,30.48 v20.59,30.48 | v19.95,26.37 19.84,26.25 PT3.E
N$27  (via drill 0.35)
  Top 0.305: 1U2.P19 39.65,28.14 v39,28.79 | v25.03,31.45 v25.03,26.37
  Bottom 0.305: v39,28.79 36.34,31.45 v25.03,31.45 | v25.03,26.37 24.91,26.25 PT4.E
N$28  (via drill 0.35)
  Top 0.305: 1U2.P20 40.92,28.26 v40.27,28.91 | v26.94,32.23 v26.94,26.37
  Bottom 0.305: v40.27,28.91 36.95,32.23 v26.94,32.23 | v26.94,26.37 28.73,26.37 PT5.E
N$29  (via drill 0.35)
  Top 0.305: 1U2.P21 41.79,25.24 41.79,28.66 40.27,30.18 33.92,30.18 32.4,28.66 v32.4,27.13
  Bottom 0.305: v32.4,27.13 33.04,27.13 PT6.E
N$30  (via drill 0.35)
  Top 0.305: v42.81,26.88 43.46,26.23 1U2.P22
  Bottom 0.305: v42.81,26.88 42.19,26.25 PT7.E
N$31  (via drill 0.35)
  Top 0.305: v45.35,26.88 44.73,26.26 1U2.P23
  Bottom 0.305: PT8.E 44.7,26.88 v45.35,26.88
OSC_IN
  Top 0.254: 1U1.5
  Top 0.305: 1C7.1 29.42,16.84 1OSC.P$2 29.48,16.21 32.53,13.16 1U1.5
OSC_OUT
  Top 0.305: 1C8.1 26.57,13.09 1OSC.P$1 29.91,12.65 1U1.6
RESET  (via drill 0.35)
  Top 0.254: 1U1.7 34.25,12.14 35.75,12.14 v37.7,14.08
  Bottom 0.254: 1S2.P$2 37.7,13.35 v37.7,14.08 36.71,15.07 1R4.1
S0  (via drill 0.35)
  Top 0.254: v65.15,7.21 63.62,5.68 53.94,5.68 49.47,10.15 1U1.26 40.97,10.15 v40.21,10.91 | v21.86,11.01 v21.86,15.57
  Bottom 0.254: v65.15,7.21 66.31,8.36 66.31,14.94 64.4,16.84 CS1.1 | v21.86,11.01 22.66,10.2 39,10.2 39.71,10.91 v40.21,10.91 | v21.86,15.57 20.59,16.84 CS2.1
S0_LS
  Top 0.254: 1U2.P10 34.57,35.25 33.28,36.53 30.11,36.53 27.95,34.37 27.95,21.04 31.76,17.23 31.76,14.87 32.98,13.65 1U1.4
S1  (via drill 0.35)
  Top 0.254: v64.4,7.96 63.64,7.2 53.72,7.2 49.76,11.15 1U1.28 42.31,11.15 40.48,12.99 v39.59,12.99
  Bottom 0.254: CS1.2 64.57,15.57 65.42,14.72 65.42,8.97 v64.4,7.96 | CS2.2 20.69,15.57 25.06,11.21 37.56,11.21 39.33,12.99 v39.59,12.99
S1_LS
  Top 0.254: 1U2.P11 33.3,35.25 32.65,35.89 31.38,35.89 28.64,33.16 28.64,21.29 32.52,17.42 32.52,14.77 33.13,14.15 1U1.3
S2  (via drill 0.35)
  Top 0.254: v56.09,6.44 55.79,6.74 53.53,6.74 49.62,10.65 1U1.27 41.87,10.65 40.6,11.91 v39.59,11.91 | v19.32,11.77 16.77,14.3 v16.77,15.57
  Bottom 0.254: v56.09,6.44 56.63,6.97 56.63,14.79 57.41,15.57 CS1.7 | v19.32,11.77 22.49,11.77 23.6,10.65 38.33,10.65 v39.59,11.91 | v16.77,15.57 CS2.7
S2_LS
  Top 0.254: 1U1.45 37.75,19.36 33.3,23.82 1U2.P14
S3  (via drill 0.35)
  Top 0.254: v53.61,4.92 53.61,5.37 49.32,9.65 1U1.25 40.21,9.65 v40.02,9.85 | v21.38,9.98 20.59,10.78 20.59,13.04 16.77,16.84 v16.27,16.84
  Bottom 0.254: v53.61,4.92 53.61,5.41 56.17,7.98 56.17,15.6 57.41,16.84 CS1.8 | v40.02,9.85 39.3,9.85 39.19,9.74 21.62,9.74 v21.38,9.98 | v16.27,16.84 CS2.8
S3_LS
  Top 0.254: 1U2.P13 32.03,23.82 37.25,18.59 1U1.46
SCL/RX
  Top 0.254: J3.4 41.03,3.89 38.26,3.89 36.25,5.9 1U1.13 36.25,9.26 36.97,9.98 36.97,10.02 37.41,10.45 37.41,12.07 39.25,13.92 1U1.42
SDA/TX
  Top 0.254: J3.3 39.25,3.38 37.22,3.38 34.24,6.36 1U1.12 34.28,9.69 36,9.69 36.95,10.64 36.95,12.26 38.75,14.06 1U1.43
VCCA  (via drill 0.35)
  Top 0.254: 1U1.9 34.23,11.13
  Top 0.305: FB1.1 30.11,6.47 1C1.1 31.38,9.64 31.38,10.49 32.02,11.13 34.23,11.13
  Top 0.406: FB1.1 v26.94,6.05
  Bottom 0.406: v26.94,6.05 13.6,6.05 1.53,18.11 1.53,25.85 PT14.C PT1.C PT2.C PT3.C PT4.C PT5.C 31.2,27.76 31.54,28.09 33.25,28.09 33.59,27.76 PT6.C PT7.C PT8.C PT9.C PT10.C PT11.C PT12.C PT13.C PT15.C

### Text on the board
tPlace: Light Sensor Breakout / MAX 3.3v power! / I2C/UART at 3v3 logic / github.com/hcbozo/projects / gnd-3v3-sda/tx-scl/rx | prog / power | gnd | 3v3 | sda/tx | scl/rx
bPlace: reset | prog / power | OFF | LIGHT | ON